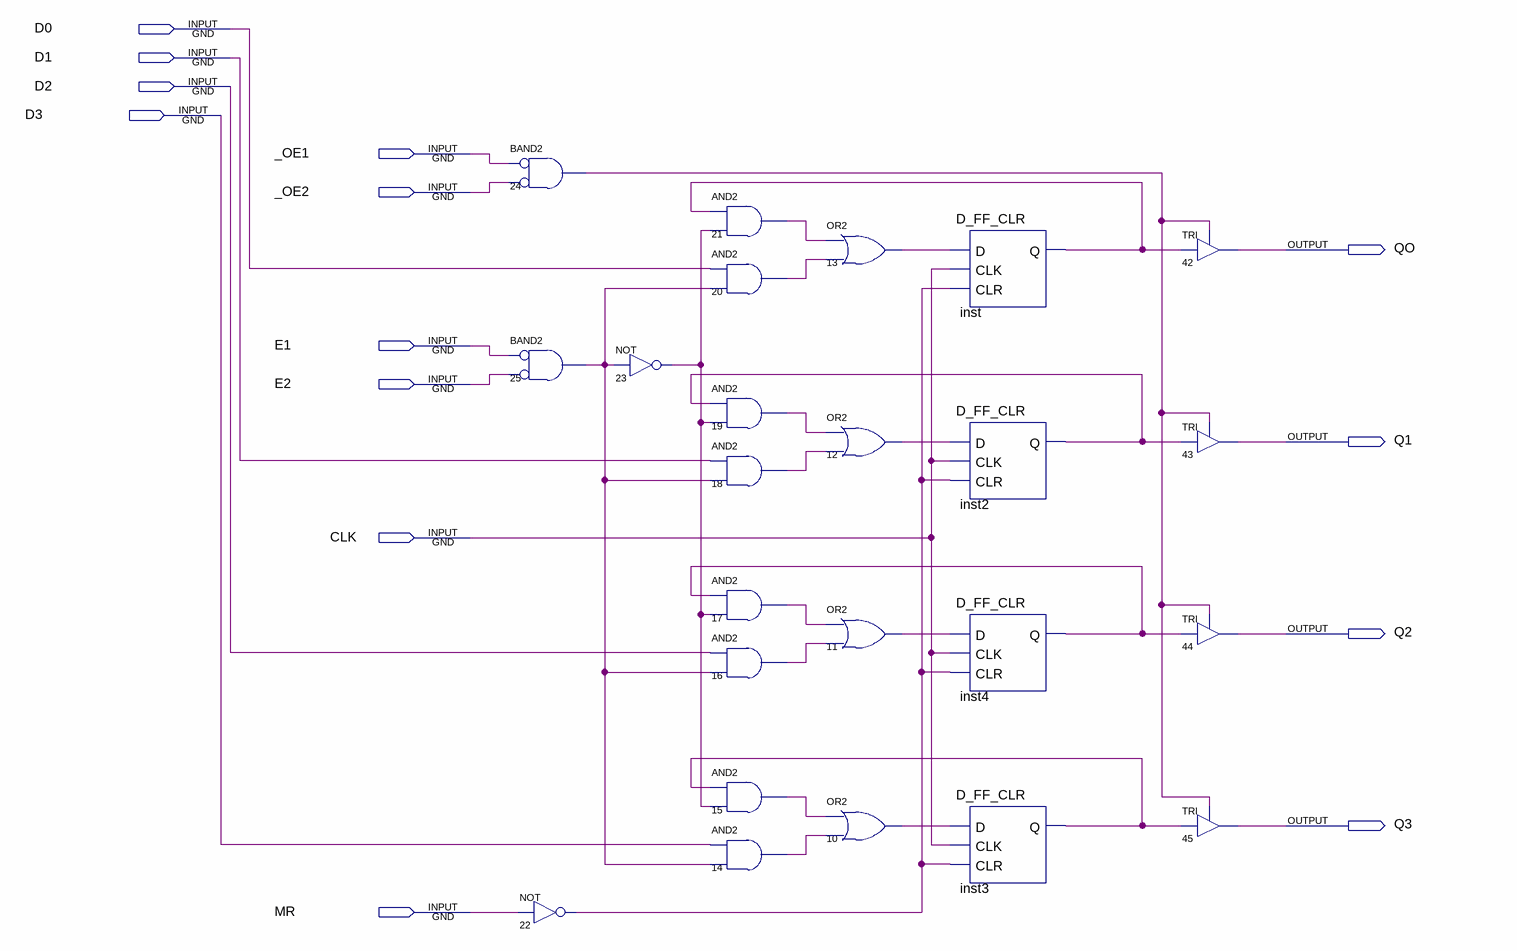
[diagram p0: schematic sheet]
// Quartus schematic 74LS173.bdf as structural Verilog: 24 symbols, 14 pins
module \74LS173  (
  input  D0,
  input  D1,
  input  D2,
  input  D3,
  input  _OE1,
  input  _OE2,
  input  E1,
  input  E2,
  input  CLK,
  input  MR,
  output QO,
  output Q1,
  output Q2,
  output Q3
);

  wire inst2_q, inst3_q, inst4_q, inst_q, n10_out, n11_out, n12_out, n13_out, n14_out, n15_out, n16_out,
       n17_out, n18_out, n19_out, n20_out, n21_out, n22_out, n23_out, n24_out, n25_out;

  and u_24 (n24_out, ~_OE1, ~_OE2);  // BAND2
  and u_25 (n25_out, ~E1, ~E2);  // BAND2
  not u_22 (n22_out, MR);
  not u_23 (n23_out, n25_out);
  and u_21 (n21_out, inst_q, n23_out);
  and u_20 (n20_out, D0, n25_out);
  and u_19 (n19_out, inst2_q, n23_out);
  and u_18 (n18_out, D1, n25_out);
  and u_17 (n17_out, inst4_q, n23_out);
  and u_16 (n16_out, D2, n25_out);
  and u_15 (n15_out, inst3_q, n23_out);
  and u_14 (n14_out, D3, n25_out);
  or u_13 (n13_out, n21_out, n20_out);
  or u_12 (n12_out, n19_out, n18_out);
  or u_11 (n11_out, n17_out, n16_out);
  or u_10 (n10_out, n15_out, n14_out);
  D_FF_CLR inst (.D(n13_out), .CLK(CLK), .CLR(n22_out), .Q(inst_q));
  D_FF_CLR inst2 (.D(n12_out), .CLK(CLK), .CLR(n22_out), .Q(inst2_q));
  D_FF_CLR inst4 (.D(n11_out), .CLK(CLK), .CLR(n22_out), .Q(inst4_q));
  D_FF_CLR inst3 (.D(n10_out), .CLK(CLK), .CLR(n22_out), .Q(inst3_q));
  TRI u_42 (.IN(inst_q), .OE(n24_out), .OUT(QO));
  TRI u_43 (.IN(inst2_q), .OE(n24_out), .OUT(Q1));
  TRI u_44 (.IN(inst4_q), .OE(n24_out), .OUT(Q2));
  TRI u_45 (.IN(inst3_q), .OE(n24_out), .OUT(Q3));
endmodule
